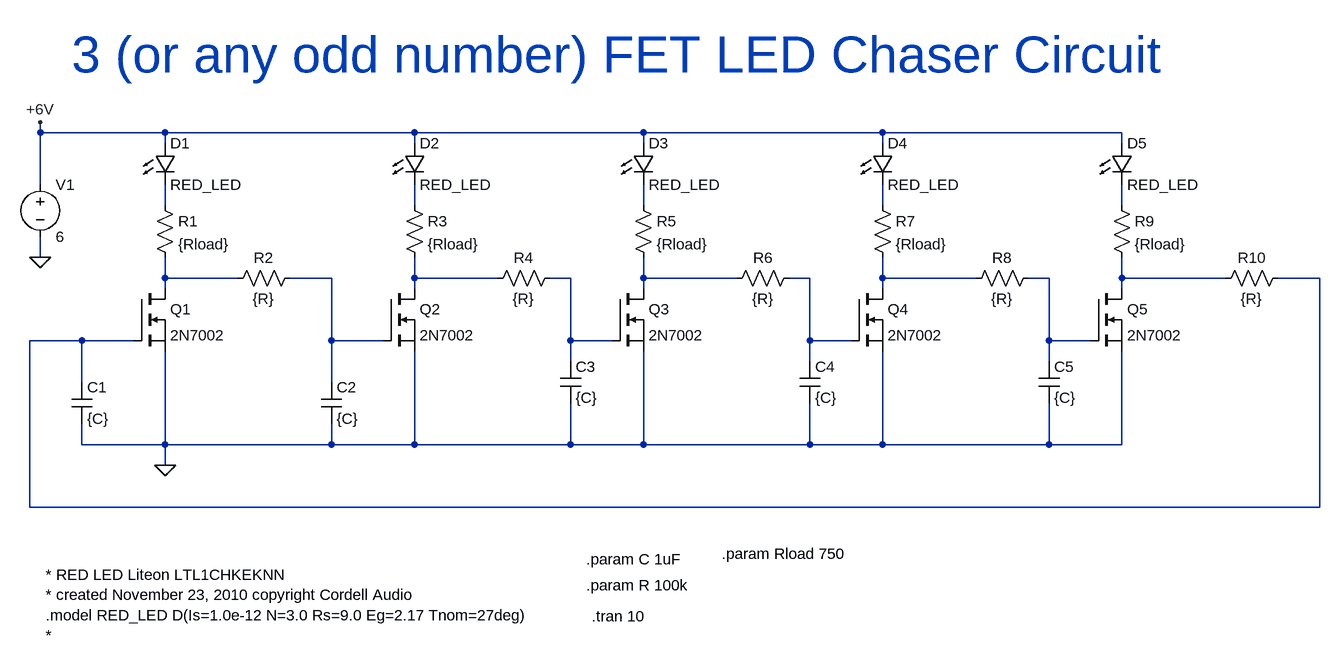
[diagram p0: schematic 5 LED Chaser.asc]
5 LED Chaser.asc, the LTspice schematic file:
Version 4
SHEET 1 1500 852
WIRE -4960 -1232 -4960 -1248
WIRE -4768 -1232 -4960 -1232
WIRE -4384 -1232 -4768 -1232
WIRE -4032 -1232 -4384 -1232
WIRE -3664 -1232 -4032 -1232
WIRE -3296 -1232 -3664 -1232
WIRE -4768 -1216 -4768 -1232
WIRE -4384 -1216 -4384 -1232
WIRE -4032 -1216 -4032 -1232
WIRE -3664 -1216 -3664 -1232
WIRE -3296 -1216 -3296 -1232
WIRE -4960 -1152 -4960 -1232
WIRE -4768 -1120 -4768 -1152
WIRE -4384 -1120 -4384 -1152
WIRE -4032 -1120 -4032 -1152
WIRE -3664 -1120 -3664 -1152
WIRE -3296 -1120 -3296 -1152
WIRE -4960 -1040 -4960 -1072
WIRE -4768 -1008 -4768 -1040
WIRE -4656 -1008 -4768 -1008
WIRE -4512 -1008 -4576 -1008
WIRE -4384 -1008 -4384 -1040
WIRE -4256 -1008 -4384 -1008
WIRE -4144 -1008 -4176 -1008
WIRE -4032 -1008 -4032 -1040
WIRE -3888 -1008 -4032 -1008
WIRE -3776 -1008 -3808 -1008
WIRE -3664 -1008 -3664 -1040
WIRE -3520 -1008 -3664 -1008
WIRE -3408 -1008 -3440 -1008
WIRE -3296 -1008 -3296 -1040
WIRE -3136 -1008 -3296 -1008
WIRE -2992 -1008 -3056 -1008
WIRE -4768 -992 -4768 -1008
WIRE -4384 -992 -4384 -1008
WIRE -4032 -992 -4032 -1008
WIRE -3664 -992 -3664 -1008
WIRE -3296 -992 -3296 -1008
WIRE -4896 -912 -4976 -912
WIRE -4816 -912 -4896 -912
WIRE -4512 -912 -4512 -1008
WIRE -4432 -912 -4512 -912
WIRE -4144 -912 -4144 -1008
WIRE -4080 -912 -4144 -912
WIRE -3776 -912 -3776 -1008
WIRE -3712 -912 -3776 -912
WIRE -3408 -912 -3408 -1008
WIRE -3344 -912 -3408 -912
WIRE -4144 -880 -4144 -912
WIRE -3776 -880 -3776 -912
WIRE -3408 -880 -3408 -912
WIRE -4896 -848 -4896 -912
WIRE -4512 -848 -4512 -912
WIRE -4896 -752 -4896 -784
WIRE -4768 -752 -4768 -896
WIRE -4768 -752 -4896 -752
WIRE -4512 -752 -4512 -784
WIRE -4512 -752 -4768 -752
WIRE -4384 -752 -4384 -896
WIRE -4384 -752 -4512 -752
WIRE -4144 -752 -4144 -816
WIRE -4144 -752 -4384 -752
WIRE -4032 -752 -4032 -896
WIRE -4032 -752 -4144 -752
WIRE -3776 -752 -3776 -816
WIRE -3776 -752 -4032 -752
WIRE -3664 -752 -3664 -896
WIRE -3664 -752 -3776 -752
WIRE -3408 -752 -3408 -816
WIRE -3408 -752 -3664 -752
WIRE -3296 -752 -3296 -896
WIRE -3296 -752 -3408 -752
WIRE -4768 -720 -4768 -752
WIRE -4976 -656 -4976 -912
WIRE -2992 -656 -2992 -1008
WIRE -2992 -656 -4976 -656
FLAG -4960 -1040 0
FLAG -4960 -1248 +6V
FLAG -4768 -720 0
SYMBOL nmos -4816 -992 R0
SYMATTR InstName Q1
SYMATTR Value 2N7002
SYMBOL LED -4784 -1216 R0
SYMATTR InstName D1
SYMATTR Value RED_LED
SYMATTR Description Diode
SYMATTR Type diode
SYMBOL voltage -4960 -1168 R0
WINDOW 123 0 0 Left 2
WINDOW 39 0 0 Left 2
SYMATTR InstName V1
SYMATTR Value 6
SYMBOL res -4784 -1136 R0
SYMATTR InstName R1
SYMATTR Value {Rload}
SYMBOL nmos -4432 -992 R0
SYMATTR InstName Q2
SYMATTR Value 2N7002
SYMBOL LED -4400 -1216 R0
SYMATTR InstName D2
SYMATTR Value RED_LED
SYMATTR Description Diode
SYMATTR Type diode
SYMBOL res -4400 -1136 R0
SYMATTR InstName R3
SYMATTR Value {Rload}
SYMBOL nmos -4080 -992 R0
SYMATTR InstName Q3
SYMATTR Value 2N7002
SYMBOL LED -4048 -1216 R0
SYMATTR InstName D3
SYMATTR Value RED_LED
SYMATTR Description Diode
SYMATTR Type diode
SYMBOL res -4048 -1136 R0
SYMATTR InstName R5
SYMATTR Value {Rload}
SYMBOL res -4560 -1024 R90
WINDOW 0 0 56 VBottom 2
WINDOW 3 32 56 VTop 2
SYMATTR InstName R2
SYMATTR Value {R}
SYMBOL cap -4912 -848 R0
SYMATTR InstName C1
SYMATTR Value {C}
SYMBOL cap -4528 -848 R0
SYMATTR InstName C2
SYMATTR Value {C}
SYMBOL cap -4160 -880 R0
SYMATTR InstName C3
SYMATTR Value {C}
SYMBOL res -4160 -1024 R90
WINDOW 0 0 56 VBottom 2
WINDOW 3 32 56 VTop 2
SYMATTR InstName R4
SYMATTR Value {R}
SYMBOL res -3040 -1024 R90
WINDOW 0 0 56 VBottom 2
WINDOW 3 32 56 VTop 2
SYMATTR InstName R10
SYMATTR Value {R}
SYMBOL nmos -3712 -992 R0
SYMATTR InstName Q4
SYMATTR Value 2N7002
SYMBOL LED -3680 -1216 R0
SYMATTR InstName D4
SYMATTR Value RED_LED
SYMATTR Description Diode
SYMATTR Type diode
SYMBOL res -3680 -1136 R0
SYMATTR InstName R7
SYMATTR Value {Rload}
SYMBOL cap -3792 -880 R0
SYMATTR InstName C4
SYMATTR Value {C}
SYMBOL res -3792 -1024 R90
WINDOW 0 0 56 VBottom 2
WINDOW 3 32 56 VTop 2
SYMATTR InstName R6
SYMATTR Value {R}
SYMBOL nmos -3344 -992 R0
SYMATTR InstName Q5
SYMATTR Value 2N7002
SYMBOL LED -3312 -1216 R0
SYMATTR InstName D5
SYMATTR Value RED_LED
SYMATTR Description Diode
SYMATTR Type diode
SYMBOL res -3312 -1136 R0
SYMATTR InstName R9
SYMATTR Value {Rload}
SYMBOL cap -3424 -880 R0
SYMATTR InstName C5
SYMATTR Value {C}
SYMBOL res -3424 -1024 R90
WINDOW 0 0 56 VBottom 2
WINDOW 3 32 56 VTop 2
SYMATTR InstName R8
SYMATTR Value {R}
TEXT -4952 -552 Left 2 !* RED LED Liteon LTL1CHKEKNN\n* created November 23, 2010 copyright Cordell Audio\n.model RED_LED D(Is=1.0e-12 N=3.0 Rs=9.0 Eg=2.17 Tnom=27deg)\n*
TEXT -4112 -488 Left 2 !.tran 10
TEXT -4912 -1352 Left 6 ;3 (or any odd number) FET LED Chaser Circuit
TEXT -4120 -576 Left 2 !.param C 1uF
TEXT -4120 -536 Left 2 !.param R 100k
TEXT -3912 -584 Left 2 !.param Rload 750

The netlist it stands for:
* 5 LED Chaser.asc
M§Q1 N006 N015 0 0 2N7002
D1 +6V N001 RED_LED
V1 +6V 0 6
R1 N001 N006 {Rload}
M§Q2 N008 N007 0 0 2N7002
D2 +6V N002 RED_LED
R3 N002 N008 {Rload}
M§Q3 N010 N009 0 0 2N7002
D3 +6V N003 RED_LED
R5 N003 N010 {Rload}
R2 N007 N006 {R}
C1 N015 0 {C}
C2 N007 0 {C}
C3 N009 0 {C}
R4 N009 N008 {R}
R10 N015 N014 {R}
M§Q4 N012 N011 0 0 2N7002
D4 +6V N004 RED_LED
R7 N004 N012 {Rload}
C4 N011 0 {C}
R6 N011 N010 {R}
M§Q5 N014 N013 0 0 2N7002
D5 +6V N005 RED_LED
R9 N005 N014 {Rload}
C5 N013 0 {C}
R8 N013 N012 {R}
.model D D
.lib standard.dio
.model NMOS NMOS
.model PMOS PMOS
.lib standard.mos
* RED LED Liteon LTL1CHKEKNN
* created November 23, 2010 copyright Cordell Audio
.model RED_LED D(Is=1.0e-12 N=3.0 Rs=9.0 Eg=2.17 Tnom=27deg)
*
.tran 10
* 3 (or any odd number) FET LED Chaser Circuit
.param C 1uF
.param R 100k
.param Rload 750
.backanno
.end